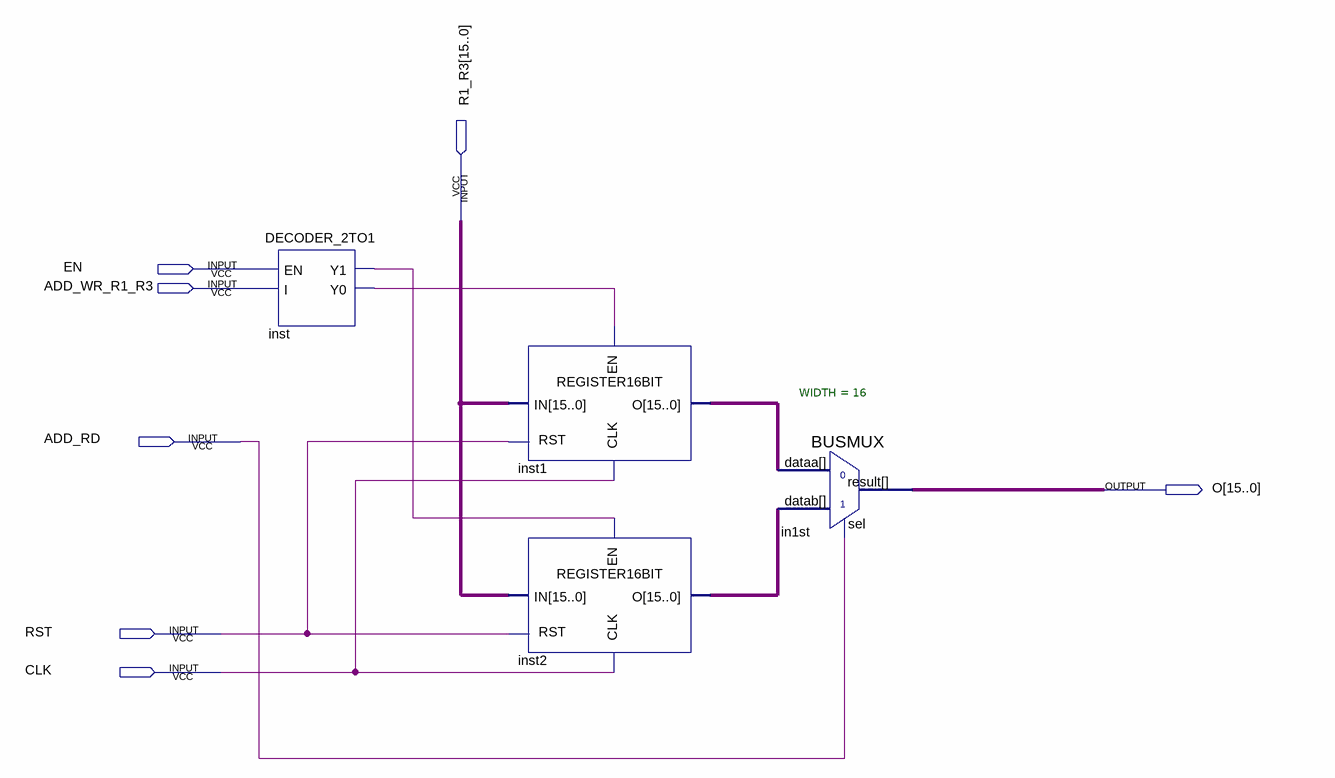
[diagram p0: schematic sheet]
// Quartus schematic RF_R1_R3.bdf as structural Verilog: 4 symbols, 7 pins
module RF_R1_R3 (
  input  [15:0] R1_R3,
  input  EN,
  input  ADD_WR_R1_R3,
  input  ADD_RD,
  input  RST,
  input  CLK,
  output [15:0] O
);

  wire inst_y0, inst_y1;
  wire [15:0] inst1_o, inst2_o;

  DECODER_2TO1 inst (.EN(EN), .I(ADD_WR_R1_R3), .Y1(inst_y1), .Y0(inst_y0));
  REGISTER16BIT inst1 (.IN(R1_R3), .EN(inst_y0), .CLK(CLK), .RST(RST), .O(inst1_o));
  REGISTER16BIT inst2 (.IN(R1_R3), .EN(inst_y1), .CLK(CLK), .RST(RST), .O(inst2_o));
  BUSMUX #(.WIDTH(16)) in1st (.datab(inst2_o), .sel(ADD_RD), .dataa(inst1_o), .result(O));
endmodule
